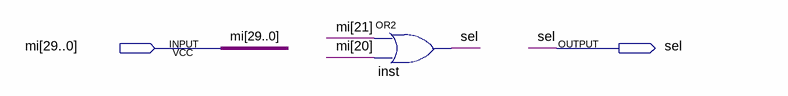
[diagram p0: schematic sheet]
// Quartus schematic uc_selector.bdf as structural Verilog: 1 symbols, 2 pins
module uc_selector (
  input  [29:0] mi,
  output sel
);

  or inst (sel, mi[21], mi[20]);
endmodule
